# EAGLE design driver (EAGLE 6.5.0)
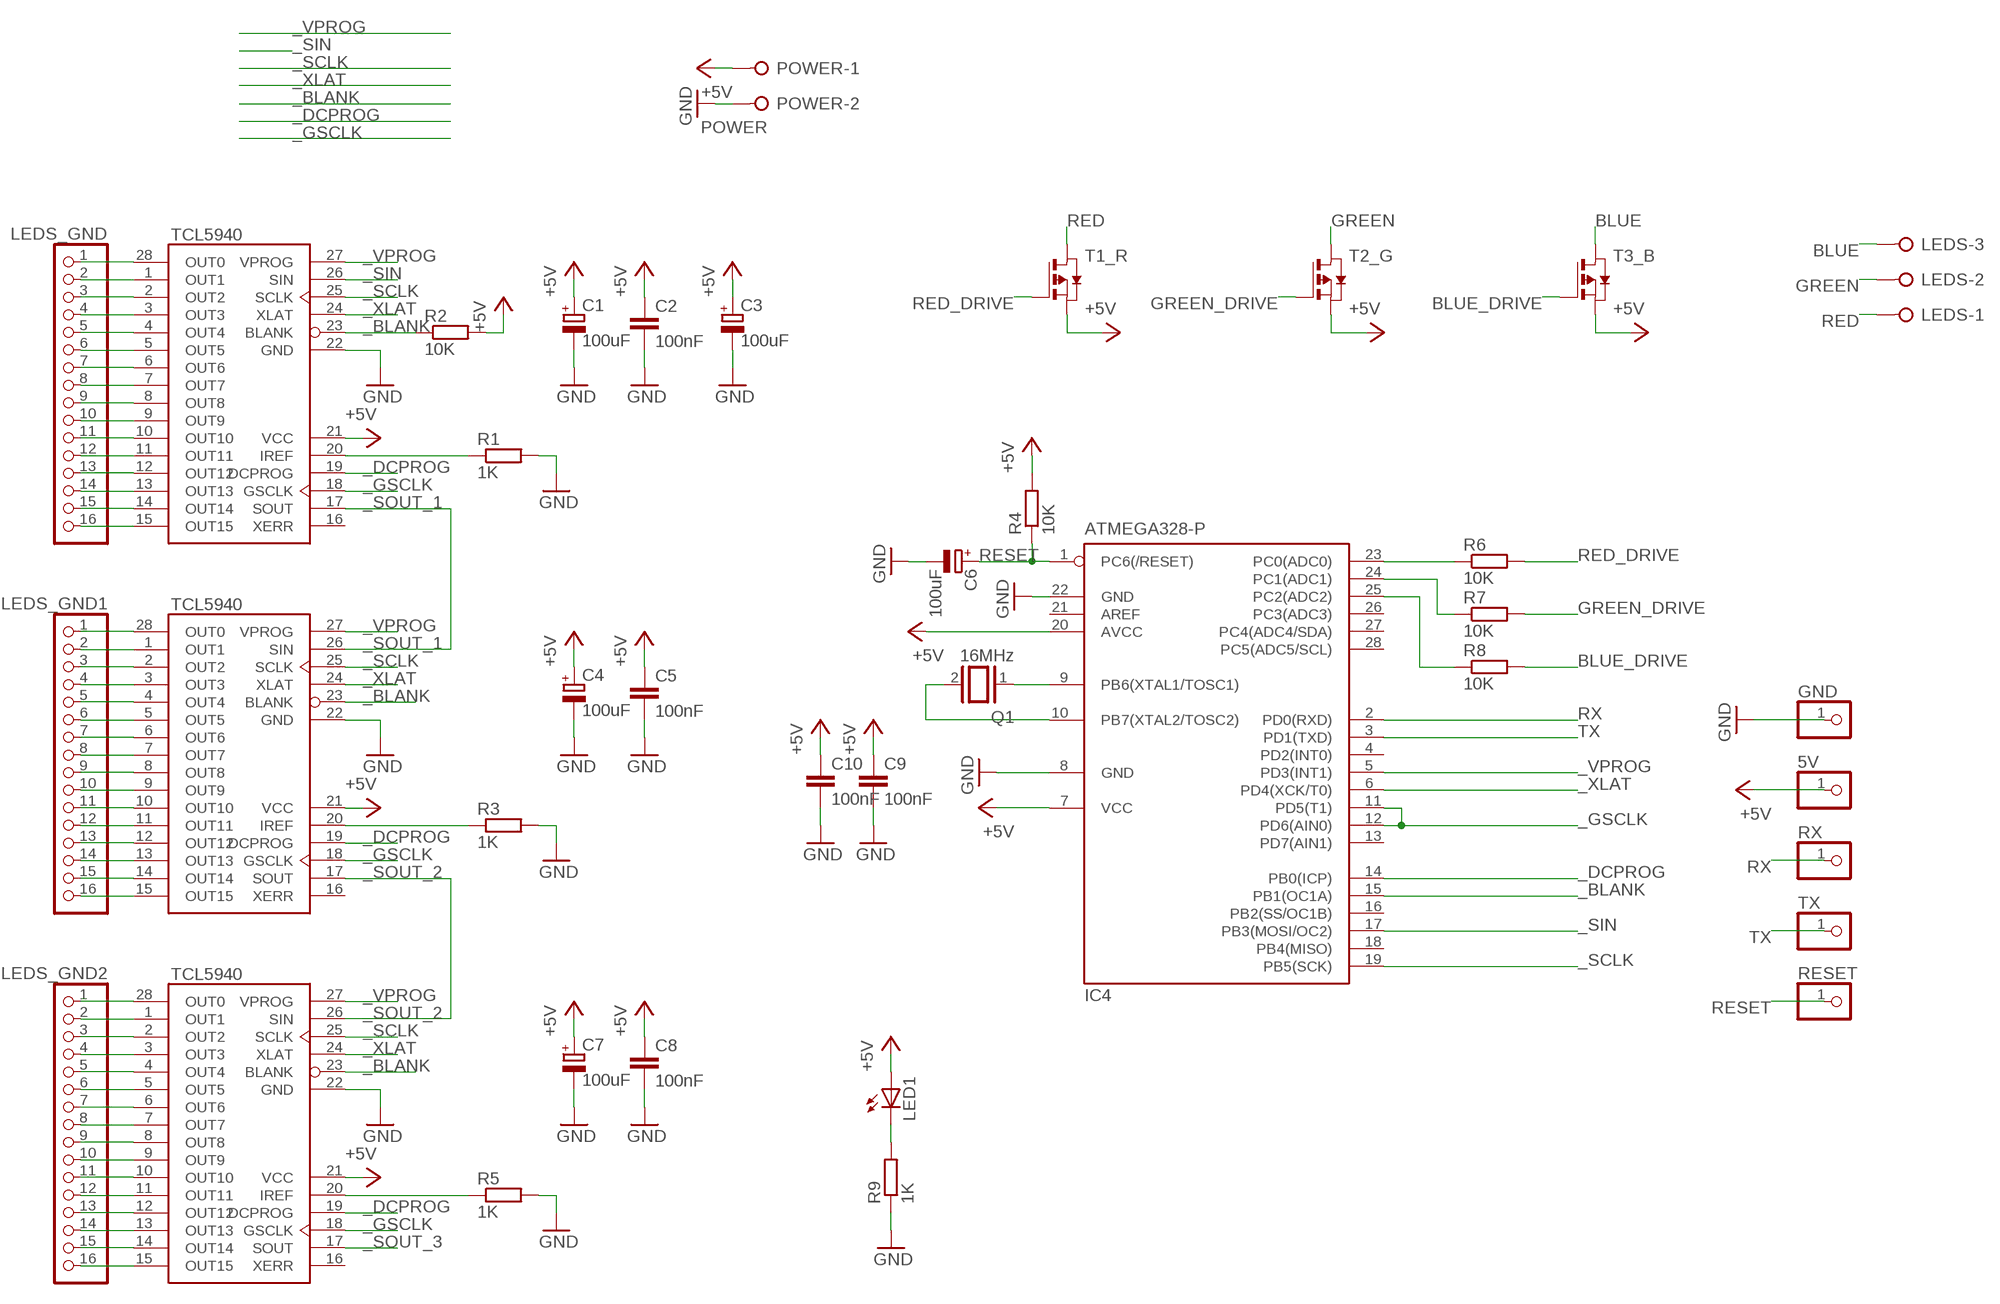
[diagram p0: schematic, sheet 1]

## Parts
5V  PINHD-1X1  [1X01]
C1  100uF  CPOL-EUE2.5-6  [E2,5-6]
C2  100nF  C-EU025-025X050  [C025-025X050]
C3  100uF  CPOL-EUE2.5-6  [E2,5-6]
C4  100uF  CPOL-EUE2.5-6  [E2,5-6]
C5  100nF  C-EU025-025X050  [C025-025X050]
C6  100uF  CPOL-EUE2.5-6  [E2,5-6]
C7  100uF  CPOL-EUE2.5-6  [E2,5-6]
C8  100nF  C-EU025-025X050  [C025-025X050]
C9  100nF  C-EU025-025X050  [C025-025X050]
C10  100nF  C-EU025-025X050  [C025-025X050]
GND  PINHD-1X1  [1X01]
IC4  ATMEGA328-P  MEGA8-P  [DIL28-3]
LED1  LED5MM  [LED5MM]
LEDS  W237-3E  [W237-3E]
LEDS_GND  PINHD-1X16  [1X16]
LEDS_GND1  PINHD-1X16  [1X16]
LEDS_GND2  PINHD-1X16  [1X16]
POWER  POWER  W237-02P  [W237-132]
Q1  16MHz  XTAL/S  [QS]
R1  1K  R-EU_M0805  [M0805]
R2  10K  R-EU_M0805  [M0805]
R3  1K  R-EU_M0805  [M0805]
R4  10K  R-EU_M0805  [M0805]
R5  1K  R-EU_M0805  [M0805]
R6  10K  R-EU_M0805  [M0805]
R7  10K  R-EU_M0805  [M0805]
R8  10K  R-EU_M0805  [M0805]
R9  1K  R-EU_M0805  [M0805]
RESET  PINHD-1X1  [1X01]
RX  PINHD-1X1  [1X01]
T1_R  PMOSSOT23  [SOT-23]
T2_G  PMOSSOT23  [SOT-23]
T3_B  PMOSSOT23  [SOT-23]
TCL5940_1  TCL5940  [DIP28]
TLC5940_2  TCL5940  [DIP28]
TLC5940_3  TCL5940  [DIP28]
TX  PINHD-1X1  [1X01]

## Nets
+5V: 5V.1 C1.+ C2.1 C3.+ C4.+ C5.1 C7.+ C8.1 C9.1 C10.1 IC4.7(VCC) IC4.20(AVCC) LED1.A POWER.1 R2.2 R4.2 T1_R.2(S) T2_G.2(S) T3_B.2(S) TCL5940_1.21(VCC) TLC5940_2.21(VCC) TLC5940_3.21(VCC)
_BLANK: IC4.15(PB1(OC1A)) R2.1 TCL5940_1.23(BLANK) TLC5940_2.23(BLANK) TLC5940_3.23(BLANK)
_DCPROG: IC4.14(PB0(ICP)) TCL5940_1.19(DCPROG) TLC5940_2.19(DCPROG) TLC5940_3.19(DCPROG)
_GSCLK: IC4.11(PD5(T1)) IC4.12(PD6(AIN0)) TCL5940_1.18(GSCLK) TLC5940_2.18(GSCLK) TLC5940_3.18(GSCLK)
_SCLK: IC4.19(PB5(SCK)) TCL5940_1.25(SCLK) TLC5940_2.25(SCLK) TLC5940_3.25(SCLK)
_SIN: IC4.17(PB3(MOSI/OC2)) TCL5940_1.26(SIN)
_SOUT_1: TCL5940_1.17(SOUT) TLC5940_2.26(SIN)
_SOUT_2: TLC5940_2.17(SOUT) TLC5940_3.26(SIN)
_SOUT_3: TLC5940_3.17(SOUT)
_VPROG: IC4.5(PD3(INT1)) TCL5940_1.27(VPROG) TLC5940_2.27(VPROG) TLC5940_3.27(VPROG)
_XLAT: IC4.6(PD4(XCK/T0)) TCL5940_1.24(XLAT) TLC5940_2.24(XLAT) TLC5940_3.24(XLAT)
BLUE: LEDS.3 T3_B.1(D)
BLUE_DRIVE: R8.2 T3_B.3(G)
GND: C1.- C2.2 C3.- C4.- C5.2 C6.- C7.- C8.2 C9.2 C10.2 GND.1 IC4.8(GND) IC4.22(GND) POWER.2 R1.2 R3.2 R5.2 R9.1 TCL5940_1.22(GND) TLC5940_2.22(GND) TLC5940_3.22(GND)
GREEN: LEDS.2 T2_G.1(D)
GREEN_DRIVE: R7.2 T2_G.3(G)
N$1: R1.1 TCL5940_1.20(IREF)
N$2: LEDS_GND.1 TCL5940_1.28(OUT0)
N$3: LEDS_GND.2 TCL5940_1.1(OUT1)
N$4: LEDS_GND.3 TCL5940_1.2(OUT2)
N$5: LEDS_GND.4 TCL5940_1.3(OUT3)
N$6: LEDS_GND.5 TCL5940_1.4(OUT4)
N$7: LEDS_GND.6 TCL5940_1.5(OUT5)
N$8: LEDS_GND.7 TCL5940_1.6(OUT6)
N$9: LEDS_GND.8 TCL5940_1.7(OUT7)
N$10: LEDS_GND.9 TCL5940_1.8(OUT8)
N$11: LEDS_GND.10 TCL5940_1.9(OUT9)
N$12: LEDS_GND.11 TCL5940_1.10(OUT10)
N$13: LEDS_GND.12 TCL5940_1.11(OUT11)
N$14: LEDS_GND.13 TCL5940_1.12(OUT12)
N$15: LEDS_GND.14 TCL5940_1.13(OUT13)
N$16: LEDS_GND.15 TCL5940_1.14(OUT14)
N$17: LEDS_GND.16 TCL5940_1.15(OUT15)
N$18: R3.1 TLC5940_2.20(IREF)
N$19: LEDS_GND1.1 TLC5940_2.28(OUT0)
N$20: LEDS_GND1.2 TLC5940_2.1(OUT1)
N$21: LEDS_GND1.3 TLC5940_2.2(OUT2)
N$22: LEDS_GND1.4 TLC5940_2.3(OUT3)
N$23: LEDS_GND1.5 TLC5940_2.4(OUT4)
N$24: LEDS_GND1.6 TLC5940_2.5(OUT5)
N$25: LEDS_GND1.7 TLC5940_2.6(OUT6)
N$26: LEDS_GND1.8 TLC5940_2.7(OUT7)
N$27: LEDS_GND1.9 TLC5940_2.8(OUT8)
N$28: LEDS_GND1.10 TLC5940_2.9(OUT9)
N$29: LEDS_GND1.11 TLC5940_2.10(OUT10)
N$30: LEDS_GND1.12 TLC5940_2.11(OUT11)
N$31: LEDS_GND1.13 TLC5940_2.12(OUT12)
N$32: LEDS_GND1.14 TLC5940_2.13(OUT13)
N$33: LEDS_GND1.15 TLC5940_2.14(OUT14)
N$34: LEDS_GND1.16 TLC5940_2.15(OUT15)
N$35: R5.1 TLC5940_3.20(IREF)
N$36: LEDS_GND2.1 TLC5940_3.28(OUT0)
N$37: LEDS_GND2.2 TLC5940_3.1(OUT1)
N$38: LEDS_GND2.3 TLC5940_3.2(OUT2)
N$39: LEDS_GND2.4 TLC5940_3.3(OUT3)
N$40: LEDS_GND2.5 TLC5940_3.4(OUT4)
N$41: LEDS_GND2.6 TLC5940_3.5(OUT5)
N$42: LEDS_GND2.7 TLC5940_3.6(OUT6)
N$43: LEDS_GND2.8 TLC5940_3.7(OUT7)
N$44: LEDS_GND2.9 TLC5940_3.8(OUT8)
N$45: LEDS_GND2.10 TLC5940_3.9(OUT9)
N$46: LEDS_GND2.11 TLC5940_3.10(OUT10)
N$47: LEDS_GND2.12 TLC5940_3.11(OUT11)
N$48: LEDS_GND2.13 TLC5940_3.12(OUT12)
N$49: LEDS_GND2.14 TLC5940_3.13(OUT13)
N$50: LEDS_GND2.15 TLC5940_3.14(OUT14)
N$51: LEDS_GND2.16 TLC5940_3.15(OUT15)
N$53: LED1.K(C) R9.2
N$54: IC4.9(PB6(XTAL1/TOSC1)) Q1.1
N$55: IC4.10(PB7(XTAL2/TOSC2)) Q1.2
N$56: IC4.23(PC0(ADC0)) R6.1
N$57: IC4.24(PC1(ADC1)) R7.1
N$58: IC4.25(PC2(ADC2)) R8.1
RED: LEDS.1 T1_R.1(D)
RED_DRIVE: R6.2 T1_R.3(G)
RESET: C6.+ IC4.1(PC6(/RESET)) R4.1 RESET.1
RX: IC4.2(PD0(RXD)) RX.1
TX: IC4.3(PD1(TXD)) TX.1
Unconnected: IC4.4(PD2(INT0)) IC4.13(PD7(AIN1)) IC4.16(PB2(SS/OC1B)) IC4.18(PB4(MISO)) IC4.21(AREF) IC4.26(PC3(ADC3)) IC4.27(PC4(ADC4/SDA)) IC4.28(PC5(ADC5/SCL)) TCL5940_1.16(XERR) TLC5940_2.16(XERR) TLC5940_3.16(XERR)

## Library data of the parts
5V GND RESET RX TX = pinhead:PINHD-1X1: PIN HEADER
C1 C3 C4 C6 C7 = resistor:CPOL-EU: POLARIZED CAPACITOR, European symbol
C2 C5 C8-C10 = resistor:C-EU: CAPACITOR, European symbol
IC4 = atmel:MEGA8-P: MICROCONTROLLER 8 Kbytes FLASH, 1 kbytes SRAM, 512 bytes EEPROM, USART, 4-channel 10 bit ADC, 2-channel 8 bit ADC Pin compatible with Atmega48, ATMega88, ATMega168 Source: avr.lbr; OC_FARNELL: unknown; OC_NEWARK: unknown
LED1 = led:LED: LED OSRAM: - CHIPLED LG R971, LG N971, LY N971, LG Q971, LY Q971, LO R971, LY R971 LH N974, LH R974 LS Q976, LO Q976, LY Q976 LO Q996 - Hyper CHIPLED LW Q18S LB Q993, LB Q99A, LB R99A - SideLED LS A670, LO A670, LY A670, LG A670, LP A670 LB A673, LV A673, LT A673, LW A673 LH A674 LY A675 LS A676, LA A676, LO A676, LY A676, LW A676 LS A679, LY A679, LG A679 - Hyper Micro SIDELED® LS Y876, LA Y876, LO Y876, LY Y876 LT Y87S - SmartLED LW L88C, LW L88S LB L89C, LB L89S, LG L890 LS L89K, LO L89K, LY L89K LS L896, LA L896, LO L896, LY L896 - TOPLED LS T670, LO T670, LY T670, LG T670, LP T670 LSG T670, LSP T670, LSY T670, LOP T670, LYG T670 LG T671, LOG T671, LSG T671 LB T673, LV T673, LT T673, LW T673 LH T674 LS T676, LA T676, LO T676, LY T676, LB T676, LH T676, LSB T676, LW T676 LB T67C, LV T67C, LT T67C, LS T67K, LO T67K, LY T67K, LW E67C LS E67B, LA E67B, LO E67B, LY E67B, LB E67C, LV E67C, LT E67C LW T67C LS T679, LY T679, LG T679 LS T770, LO T770, LY T770, LG T770, LP T770 LB T773, LV T773, LT T773, LW T773 LH T774 LS E675, LA E675, LY E675, LS T675 LS T776, LA T776, LO T776, LY T776, LB T776 LHGB T686 LT T68C, LB T68C - Hyper Mini TOPLED® LB M676 - Mini TOPLED Santana® LG M470 LS M47K, LO M47K, LY M47K Source: http://www.osram.convergy.de LUXEON: - LUMILED® LXK2-PW12-R00, LXK2-PW12-S00, LXK2-PW14-U00, LXK2-PW14-V00 LXK2-PM12-R00, LXK2-PM12-S00, LXK2-PM14-U00 LXK2-PE12-Q00, LXK2-PE12-R00, LXK2-PE12-S00, LXK2-PE14-T00, LXK2-PE14-U00 LXK2-PB12-K00, LXK2-PB12-L00, LXK2-PB12-M00, LXK2-PB14-N00, LXK2-PB14-P00, LXK2-PB14-Q00 LXK2-PR12-L00, LXK2-PR12-M00, LXK2-PR14-Q00, LXK2-PR14-R00 LXK2-PD12-Q00, LXK2-PD12-R00, LXK2-PD12-S00 LXK2-PH12-R00, LXK2-PH12-S00 LXK2-PL12-P00, LXK2-PL12-Q00, LXK2-PL12-R00 Source: www.luxeon.com KINGBRIGHT: KA-3528ASYC Source: www.kingbright.com
LEDS = con-wago-508:W237-3E: WAGO SREW CLAMP; OC_FARNELL: unknown; OC_NEWARK: unknown
LEDS_GND LEDS_GND1 LEDS_GND2 = pinhead:PINHD-1X16: PIN HEADER
POWER = con-wago-508:W237-02P: WAGO SREW CLAMP; OC_FARNELL: unknown; OC_NEWARK: unknown
Q1 = special:XTAL/S: CRYSTAL
R1-R9 = resistor:R-EU_: RESISTOR, European symbol
T1_R T2_G T3_B = zetex:PMOSSOT23: MOS FET; OC_FARNELL: unknown; OC_NEWARK: unknown
TCL5940_1 TLC5940_2 TLC5940_3 = tlc594X:TCL5940: 16-Channel 12-Bit LED Driver

## Board
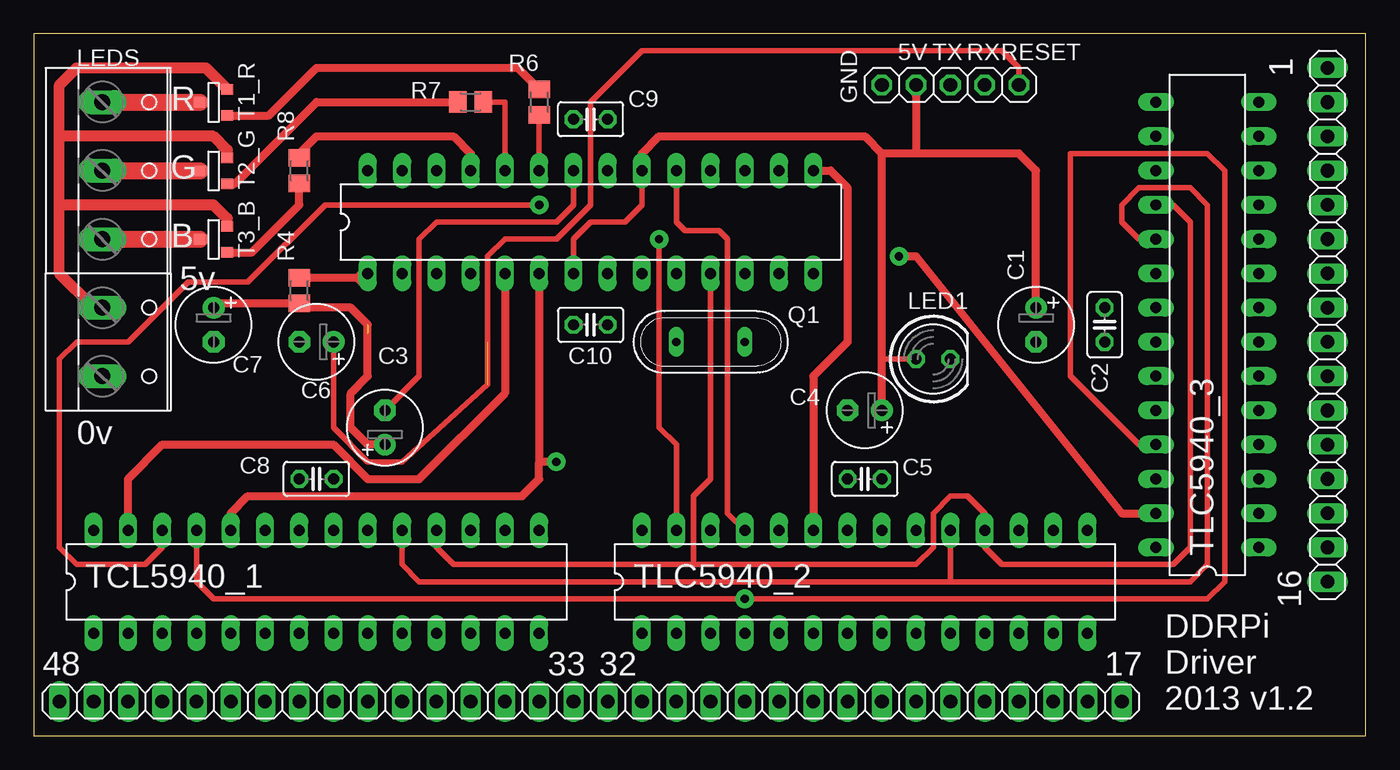
[diagram p1: board, top side]
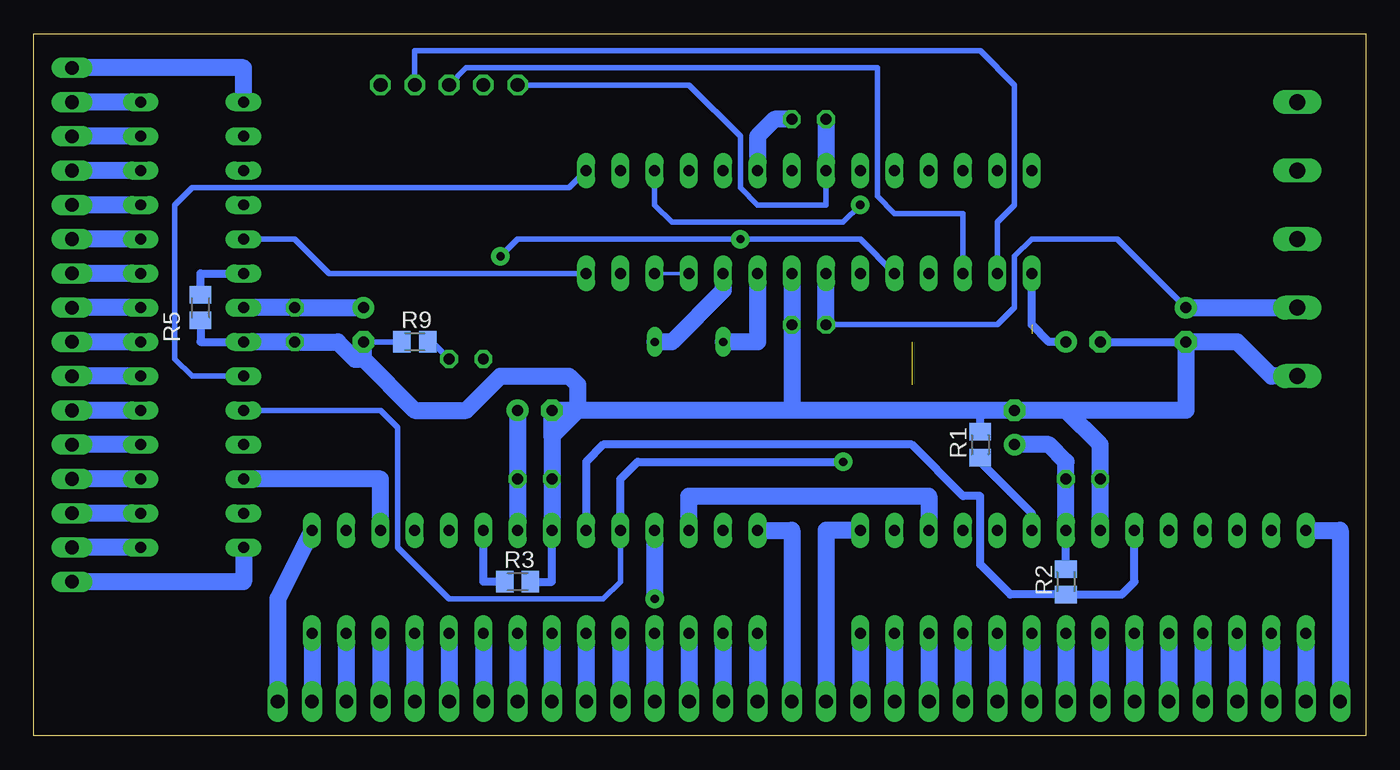
[diagram p2: board, bottom side, seen from below]

Size 98.73 x 52.06 mm. Coordinates in mm from the lower left corner, seen from the top.
Outline: 0,0 98.73,0 98.73,52.06 0,52.06 0,0
Copper layers (1*16): Top 0.035mm / dielectric 1.5mm / Bottom 0.035mm
Design rules "default *": minimum track width 10mil, minimum drill 24mil, track to track 10mil, track to pad 10mil, pad to pad 10mil, via to via 10mil, smd to smd 10mil, copper to edge 40mil, drill to drill 8mil, minimum pad ring 10mil, minimum via ring 15mil, stop-mask expansion 4mil, vias tented up to drill 0mil, thermal gap 10mil

### Footprints (pad centres in the part's own frame; a part is rotated, then mirrored left to right if it is on the bottom)
1X01 = drill 1.016 octagon: 1 0,0
E2,5-6 = drill 0.813 pad 1.6: + -1.27,0 | drill 0.813 pad 1.6 octagon: - 1.27,0
C025-025X050 = drill 0.813 octagon: 1 -1.27,0; 2 1.27,0
DIL28-3 = drill 0.813 long: 1 -16.51,-3.81; 2 -13.97,-3.81; 3 -11.43,-3.81; 4 -8.89,-3.81; 5 -6.35,-3.81; 6 -3.81,-3.81; 7 -1.27,-3.81; 8 1.27,-3.81; 9 3.81,-3.81; 10 6.35,-3.81; 11 8.89,-3.81; 12 11.43,-3.81; 13 13.97,-3.81; 14 16.51,-3.81; 15 16.51,3.81; 16 13.97,3.81; 17 11.43,3.81; 18 8.89,3.81; 19 6.35,3.81; 20 3.81,3.81; 21 1.27,3.81; 22 -1.27,3.81; 23 -3.81,3.81; 24 -6.35,3.81; 25 -8.89,3.81; 26 -11.43,3.81; 27 -13.97,3.81; 28 -16.51,3.81
LED5MM = drill 0.813 octagon: A -1.27,0; K 1.27,0
W237-3E = drill 1.194 long: 1 -5.08,-0.635; 2 0,-0.635; 3 5.08,-0.635
1X16 = drill 1.016 long: 1 -19.05,0; 2 -16.51,0; 3 -13.97,0; 4 -11.43,0; 5 -8.89,0; 6 -6.35,0; 7 -3.81,0; 8 -1.27,0; 9 1.27,0; 10 3.81,0; 11 6.35,0; 12 8.89,0; 13 11.43,0; 14 13.97,0; 15 16.51,0; 16 19.05,0
W237-132 = drill 1.194 long: 1 -2.54,-0.635; 2 2.54,-0.635
QS = drill 0.61 long: 1 -2.54,0; 2 2.54,0
M0805 = smd 1.3 x 1.6: 1 -0.95,0; 2 0.95,0
SOT-23 = smd 0.787 x 0.889: 1 0.025,-1.016; 2 -0.94,1.016; 3 0.991,1.016
DIP28 = drill 0.813 long: 1 -15.24,-3.81; 2 -12.7,-3.81; 3 -10.16,-3.81; 4 -7.62,-3.81; 5 -5.08,-3.81; 6 -2.54,-3.81; 7 0,-3.81; 8 2.54,-3.81; 9 5.08,-3.81; 10 7.62,-3.81; 11 10.16,-3.81; 12 12.7,-3.81; 13 15.24,-3.81; 14 17.78,-3.81; 15 17.78,3.81; 16 15.24,3.81; 17 12.7,3.81; 18 10.16,3.81; 19 7.62,3.81; 20 5.08,3.81; 21 2.54,3.81; 22 0,3.81; 23 -2.54,3.81; 24 -5.08,3.81; 25 -7.62,3.81; 26 -10.16,3.81; 27 -12.7,3.81; 28 -15.24,3.81

### Placement (x,y rotation side)
5V  65.41,48.26 0 top
C1  74.3,30.48 270 top
C2  79.38,30.48 270 top
C3  26.04,22.86 90 top
C4  61.59,24.13 180 top
C5  61.59,19.05 180 top
C6  20.95,29.21 180 top
C7  13.34,30.48 270 top
C8  20.95,19.05 180 top
C9  41.27,45.72 180 top
C10  41.27,30.48 0 top
GND  62.87,48.26 90 top
IC4  41.27,38.1 0 top
LED1  66.67,27.94 0 top
LEDS  5.71,41.91 270 top
LEDS_GND  20.95,2.54 0 top
LEDS_GND1  61.59,2.54 0 top
LEDS_GND2  95.88,30.48 90 top
POWER  5.71,29.21 270 top
Q1  50.16,29.21 0 top
R1  28.57,21.59 90 bottom
R2  22.22,11.43 90 bottom
R3  62.87,11.43 0 bottom
R4  19.68,33.02 270 top
R5  86.36,31.75 270 bottom
R6  37.47,46.99 90 top
R7  32.39,46.99 180 top
R8  19.68,41.91 270 top
R9  70.48,29.21 0 bottom
RESET  73.02,48.26 0 top
RX  70.48,48.26 0 top
T1_R  13.34,46.99 270 top
T2_G  13.34,41.91 270 top
T3_B  13.34,36.83 270 top
TCL5940_1  19.68,11.43 0 top
TLC5940_2  60.33,11.43 0 top
TLC5940_3  86.99,29.21 90 top
TX  67.94,48.26 0 top

### Tracks (layer width: path | path; a pad name or v marks a point on that pad's centre or on a via)
+5V
  Top 0.254: 19.68,31.75 R4.2
  Top 0.406: IC4.7 40.01,36.83 41.27,38.1 43.82,38.1 45.09,39.37 IC4.20 | LED1.A 62.87,27.94
  Top 0.61: C7.+ 13.65,32.07 R4.2 20,31.75 23.49,31.75 24.76,30.48 24.76,26.67 23.49,25.4 23.49,22.86 24.76,21.59 C3.+ | C4.+ 62.87,27.94 62.87,43.18 | IC4.20 45.09,43.18 46.36,44.45 61.59,44.45 62.87,43.18 | C1.+ 74.3,41.91 73.02,43.18 65.41,43.18 | 65.41,43.18 62.87,43.18 | 5V.1 65.41,43.18
  Top 0.813: POWER.1 4.45,31.75 1.91,34.29 1.91,39.37 | 1.91,39.37 1.91,44.45 | 1.91,44.45 1.91,48.26 3.17,49.53 12.75,49.53 T1_R.2 | T2_G.2 14.35,43.43 13.34,44.45 1.91,44.45 | T3_B.2 14.35,38.35 13.34,39.37 1.91,39.37
  Bottom 0.406: C10.1 27.3,30.48 26.04,31.75 26.04,35.56 24.76,36.83 18.41,36.83 C7.+
  Bottom 0.61: R2.2 TCL5940_1.21
  Bottom 1.27: C1.+ C2.1 TLC5940_3.21 | TLC5940_2.21 C5.1 C4.+ | C10.1 IC4.7 | C9.1 43.82,45.72 45.09,44.45 IC4.20 | C7.+ POWER.1 | TCL5940_1.21 C8.1 22.22,20.32 23.49,21.59 C3.+
_BLANK
  Top 0.61: IC4.15 59.05,41.91 60.33,40.64 60.33,29.21 57.79,26.67 TLC5940_2.23
  Bottom 0.406: TLC5940_3.23 86.99,26.67 88.27,27.94 88.27,39.37 86.99,40.64 59.05,40.64 IC4.15
  Bottom 0.61: TCL5940_1.23 17.14,11.43 18.09,10.48 R2.1 26.35,10.48 28.57,12.7 28.57,17.78 29.84,17.78 33.66,21.59 56.52,21.59 57.79,20.32 TLC5940_2.23
_DCPROG
  Top 0.406: TCL5940_1.19 27.3,12.7 28.57,11.43 67.94,11.43 | 67.94,11.43 85.72,11.43 86.99,12.7 86.99,39.37 85.72,40.64 81.91,40.64 80.64,39.37 80.64,38.1 81.91,36.83 TLC5940_3.19 | TLC5940_2.19 67.94,11.43
  Bottom 0.406: IC4.14 76.83,34.29 79.38,36.83 TLC5940_3.19
_GSCLK
  Top 0.406: TLC5940_3.18 84.45,39.37 85.72,38.1 85.72,13.97 84.45,12.7 71.75,12.7 70.48,13.97 TLC5940_2.18 70.48,16.51 69.21,17.78 67.94,17.78 66.67,16.51 66.67,13.97 65.41,12.7 48.9,12.7 | 48.9,12.7 31.11,12.7 29.84,13.97 TCL5940_1.18 | IC4.11 50.16,19.05 48.9,17.78 48.9,12.7
  Bottom 0.254: IC4.12 IC4.11
_SCLK  (via drill 0.61)
  Top 0.406: TCL5940_1.25 12.06,11.43 13.34,10.16 v52.71,10.16 86.99,10.16 88.27,11.43 88.27,41.91 86.99,43.18 76.83,43.18 76.83,26.67 81.91,21.59 TLC5940_3.25 | IC4.19 47.62,38.1 48.26,37.47 50.8,37.47 51.44,36.83 51.44,16.51 TLC5940_2.25
  Bottom 1.27: TLC5940_2.25 v52.71,10.16
_SIN  (via drill 0.61)
  Top 0.406: v37.47,39.37 21.59,39.37 15.88,33.66 11.43,33.66 6.99,29.21 3.17,29.21 1.91,27.94 1.91,13.97 3.17,12.7 8.26,12.7 9.53,13.97 TCL5940_1.26
  Bottom 0.406: v37.47,39.37 38.73,38.1 51.44,38.1 52.71,39.37 IC4.17
_SOUT_1
  Bottom 1.27: TLC5940_2.26 50.16,17.78 32.39,17.78 TCL5940_1.17
_SOUT_2
  Bottom 1.27: TLC5940_2.17 73.02,19.05 TLC5940_3.26
_VPROG  (via drill 0.61)
  Top 0.406: TLC5940_2.27 47.62,21.59 46.36,22.86 v46.36,36.83
  Top 0.61: TCL5940_1.27 6.99,19.05 9.53,21.59 22.22,21.59 24.76,19.05 28.57,19.05 34.93,25.4 IC4.5 | v64.13,35.56 65.41,35.56 80.64,16.51 TLC5940_3.27
  Bottom 0.406: v64.13,35.56 62.87,36.83 v46.36,36.83 37.47,36.83 IC4.5
_XLAT  (via drill 0.61)
  Top 0.61: IC4.6 37.47,20.32 | v38.73,20.32 37.47,20.32 | TCL5940_1.24 14.61,16.51 15.88,17.78 36.2,17.78 37.47,19.05 37.47,20.32
  Bottom 0.406: TLC5940_2.24 55.25,11.43 56.52,10.16 67.94,10.16 71.75,13.97 71.75,22.86 73.02,24.13 TLC5940_3.24
  Bottom 0.61: TLC5940_2.24 55.25,19.05 53.98,20.32 v38.73,20.32
BLUE
  Top 1.27: T3_B.1 5.11,36.8 LEDS.3
BLUE_DRIVE
  Top 0.61: T3_B.3 16.15,35.84 19.68,39.37 R8.2
GND
  Top 0.406: IC4.22 40.01,39.37 38.73,38.1 29.84,38.1 28.57,36.83 28.57,26.67 C3.-
  Bottom 0.406: IC4.22 40.01,39.37 45.09,39.37 46.36,40.64 46.36,44.45 50.16,48.26 GND.1 | R9.1 C1.-
  Bottom 0.61: R5.2 86.36,29.21 TLC5940_3.22 | R3.2 60.33,11.43 TLC5940_2.22 | C6.- C7.- | R1.2 28.57,24.13
  Bottom 1.27: 74.3,27.94 74.93,27.94 76.2,29.21 C2.2 TLC5940_3.22 | TLC5940_2.22 C5.2 C4.- | C9.2 IC4.22 | IC4.8 C10.2 42.55,24.13 | POWER.2 6.99,26.67 9.53,29.21 C7.- 13.34,24.13 22.22,24.13 | TCL5940_1.22 C8.2 19.68,21.59 22.22,24.13 | 22.22,24.13 C3.- 28.57,24.13 42.55,24.13 | 42.55,24.13 C4.- | 74.3,27.94 70.48,24.13 66.67,24.13 64.13,26.67 59.05,26.67 58.42,26.04 58.42,24.13 60.33,22.23 C4.- | 74.3,27.94 C1.-
GREEN
  Top 1.27: T2_G.1 5.11,41.88 LEDS.2
GREEN_DRIVE
  Top 0.61: T2_G.3 14.88,40.92 20.95,46.99 R7.2
N$1
  Bottom 0.61: R1.1 28.57,20.32 24.76,16.51 TCL5940_1.20
N$2
  Bottom 1.27: TCL5940_1.28 1.91,15.24 LEDS_GND.1
N$3
  Bottom 1.27: TCL5940_1.1 LEDS_GND.2
N$4
  Bottom 1.27: TCL5940_1.2 LEDS_GND.3
N$5
  Bottom 1.27: TCL5940_1.3 LEDS_GND.4
N$6
  Bottom 1.27: TCL5940_1.4 LEDS_GND.5
N$7
  Bottom 1.27: TCL5940_1.5 LEDS_GND.6
N$8
  Bottom 1.27: TCL5940_1.6 LEDS_GND.7
N$9
  Bottom 1.27: TCL5940_1.7 LEDS_GND.8
N$10
  Bottom 1.27: TCL5940_1.8 LEDS_GND.9
N$11
  Bottom 1.27: TCL5940_1.9 LEDS_GND.10
N$12
  Bottom 1.27: TCL5940_1.10 LEDS_GND.11
N$13
  Bottom 1.27: TCL5940_1.11 LEDS_GND.12
N$14
  Bottom 1.27: TCL5940_1.12 LEDS_GND.13
N$15
  Bottom 1.27: TCL5940_1.13 LEDS_GND.14
N$16
  Bottom 1.27: TCL5940_1.14 LEDS_GND.15
N$17
  Bottom 1.27: TCL5940_1.15 40.01,15.24 LEDS_GND.16
N$18
  Bottom 0.61: R3.1 65.41,11.43 TLC5940_2.20
N$19
  Bottom 1.27: TLC5940_2.28 42.55,15.24 LEDS_GND1.1
N$20
  Bottom 1.27: TLC5940_2.1 LEDS_GND1.2
N$21
  Bottom 1.27: TLC5940_2.2 LEDS_GND1.3
N$22
  Bottom 1.27: TLC5940_2.3 LEDS_GND1.4
N$23
  Bottom 1.27: TLC5940_2.4 LEDS_GND1.5
N$24
  Bottom 1.27: TLC5940_2.5 LEDS_GND1.6
N$25
  Bottom 1.27: TLC5940_2.6 LEDS_GND1.7
N$26
  Bottom 1.27: TLC5940_2.7 LEDS_GND1.8
N$27
  Bottom 1.27: TLC5940_2.8 LEDS_GND1.9
N$28
  Bottom 1.27: TLC5940_2.9 LEDS_GND1.10
N$29
  Bottom 1.27: TLC5940_2.10 LEDS_GND1.11
N$30
  Bottom 1.27: TLC5940_2.11 LEDS_GND1.12
N$31
  Bottom 1.27: TLC5940_2.12 LEDS_GND1.13
N$32
  Bottom 1.27: TLC5940_2.13 LEDS_GND1.14
N$33
  Bottom 1.27: TLC5940_2.14 LEDS_GND1.15
N$34
  Bottom 1.27: TLC5940_2.15 80.64,10.16 LEDS_GND1.16
N$35
  Bottom 0.61: R5.1 86.36,34.29 TLC5940_3.20
N$36
  Bottom 1.27: TLC5940_3.28 83.18,11.43 LEDS_GND2.1
N$37
  Bottom 1.27: TLC5940_3.1 LEDS_GND2.2
N$38
  Bottom 1.27: TLC5940_3.2 LEDS_GND2.3
N$39
  Bottom 1.27: TLC5940_3.3 LEDS_GND2.4
N$40
  Bottom 1.27: TLC5940_3.4 LEDS_GND2.5
N$41
  Bottom 1.27: TLC5940_3.5 LEDS_GND2.6
N$42
  Bottom 1.27: TLC5940_3.6 LEDS_GND2.7
N$43
  Bottom 1.27: TLC5940_3.7 LEDS_GND2.8
N$44
  Bottom 1.27: TLC5940_3.8 LEDS_GND2.9
N$45
  Bottom 1.27: TLC5940_3.9 LEDS_GND2.10
N$46
  Bottom 1.27: TLC5940_3.10 LEDS_GND2.11
N$47
  Bottom 1.27: TLC5940_3.11 LEDS_GND2.12
N$48
  Bottom 1.27: TLC5940_3.12 LEDS_GND2.13
N$49
  Bottom 1.27: TLC5940_3.13 LEDS_GND2.14
N$50
  Bottom 1.27: TLC5940_3.14 LEDS_GND2.15
N$51
  Bottom 1.27: TLC5940_3.15 83.18,49.53 LEDS_GND2.16
N$53
  Bottom 0.406: R9.2 69.21,29.21 LED1.K
N$54
  Bottom 1.27: IC4.9 45.09,29.21 Q1.1
N$55
  Bottom 1.27: IC4.10 47.62,33.02 51.44,29.21 Q1.2
N$56
  Top 0.406: IC4.23 R6.1
N$57
  Top 0.406: R7.1 34.93,46.99 IC4.24
N$58
  Top 0.61: R8.1 19.68,43.18 20.95,44.45 31.11,44.45 32.39,43.18 IC4.25
RED
  Top 1.27: T1_R.1 5.11,46.97 LEDS.1
RED_DRIVE
  Top 0.61: T1_R.3 17.42,46 20.95,49.53 35.88,49.53 R6.2
RESET  (3 unrouted)
  Top 0.406: RESET.1 73.02,49.53 71.75,50.8 45.09,50.8 41.27,46.99 41.27,39.37 38.73,36.83 34.93,36.83 33.66,35.56 33.66,26.04 27.3,20.32 24.76,20.32 22.22,22.86 C6.+
  Top 0.61: R4.1 24.44,33.97
  Top 1.27: 24.44,33.97 IC4.1
  Bottom 0.61: C6.+ 23.49,29.21 24.76,30.48 IC4.1
RX
  Bottom 0.406: IC4.2 27.3,38.1 26.04,39.37 26.04,48.26 28.57,50.8 70.48,50.8 RX.1
TX
  Bottom 0.406: IC4.3 29.84,38.73 34.93,38.73 36.2,40.01 36.2,49.53 66.67,49.53 TX.1

### Text on the board
tPlace: 1 | R | G | B | 5v | 0v | 16 | 48 | 33 | 32 | 17 | DDRPi / Driver / 2013 v1.2